# Altium schematic sheet ss.SchDoc
size A
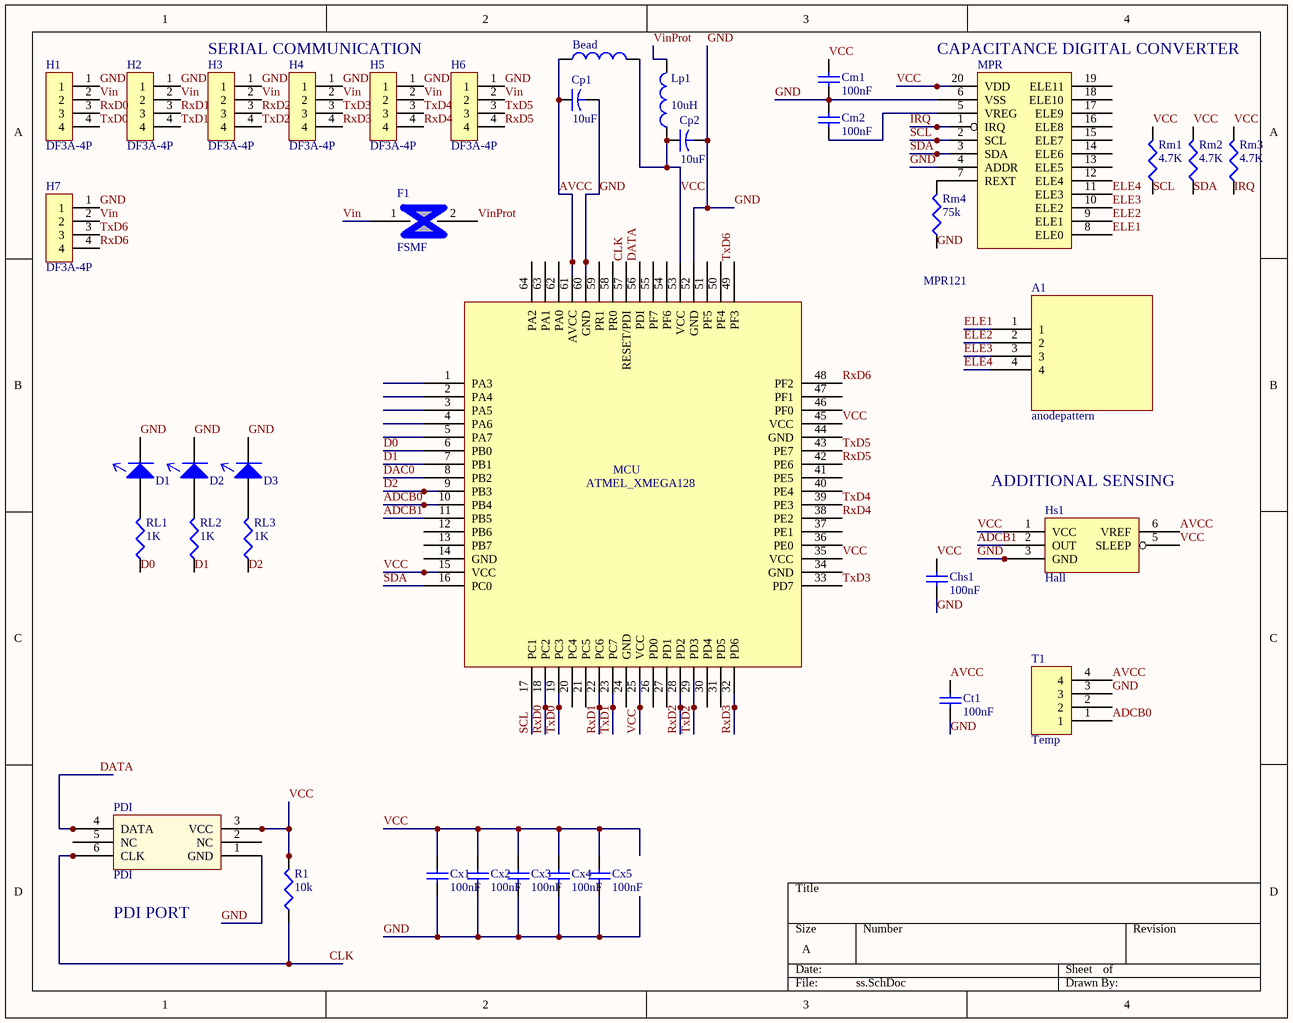
[diagram p0: ss.SchDoc]

## Parts
A1  anodepattern  [anodepattern]
Bead  (no value)  [C0402-DRL]
Chs1  value 100nF  [C0402-DRL]
Cm1  value 100nF  [C0402-DRL]
Cm2  value 100nF  [C0402-DRL]
Cp1  value 10uF  [C0603-DRL]
Cp2  value 10uF  [C0603-DRL]
Ct1  value 100nF  [C0402-DRL]
Cx1  value 100nF  [C0402-DRL]
Cx2  value 100nF  [C0402-DRL]
Cx3  value 100nF  [C0402-DRL]
Cx4  value 100nF  [C0402-DRL]
Cx5  value 100nF  [C0402-DRL]
D1  LEDSMD  [D1206-DRL]  (value not drawn)
D2  LEDSMD  [D1206-DRL]  (value not drawn)
D3  LEDSMD  [D1206-DRL]  (value not drawn)
F1  FSMF  [C0603-DRL]
H1  DF3A-4P  [UART]
H2  DF3A-4P  [UART]
H3  DF3A-4P  [UART]
H4  DF3A-4P  [UART]
H5  DF3A-4P  [UART]
H6  DF3A-4P  [UART]
H7  DF3A-4P  [UART]
Hs1  Hall  [HALL]
Lp1  value 10uH  [C0603-DRL]
MCU  ATMEL_XMEGA128  [QFN50P900X900X100-64N]
MPR  MPR121  [QFN40P300X300X60-20N]
PDI  PDI  [PDI_SMT]
R1  value 10k  [R0402-DRL]  (hidden comment: R)
RL1  value 1K  [R0402-DRL]  (hidden comment: R)
RL2  value 1K  [R0402-DRL]  (hidden comment: R)
RL3  value 1K  [R0402-DRL]  (hidden comment: R)
Rm1  value 4.7K  [R0402-DRL]  (hidden comment: R)
Rm2  value 4.7K  [R0402-DRL]  (hidden comment: R)
Rm3  value 4.7K  [R0402-DRL]  (hidden comment: R)
Rm4  value 75k  [R0603-DRL]  (hidden comment: R)
T1  Temp  [QFN50P100X130X55-4N]

## Nets
ADCB0: MCU.10(PB4) T1.1
ADCB1: Hs1.2(OUT) MCU.11(PB5)
AVCC: Bead.1 Cp1.1 Ct1.2 Hs1.6(VREF) MCU.61(AVCC) T1.4
CLK: MCU.57(RESET/PDI) PDI.6(CLK) R1.1
D0: MCU.6(PB0) RL1.1
D1: MCU.7(PB1) RL2.1
D2: MCU.9(PB3) RL3.1
DAC0: MCU.8(PB2)
DATA: MCU.56(PDI) PDI.4(DATA)
ELE1: A1.1 MPR.8(ELE0)
ELE2: A1.2 MPR.9(ELE1)
ELE3: A1.3 MPR.10(ELE2)
ELE4: A1.4 MPR.11(ELE3)
GND: Chs1.1 Cm1.1 Cm2.1 Cp1.2 Cp2.2 Ct1.1 Cx1.1 Cx2.1 Cx3.1 Cx4.1 Cx5.1 D1.1(K) D2.1(K) D3.1(K) H1.1 H2.1 H3.1 H4.1 H5.1 H6.1 H7.1 Hs1.3(GND) MCU.52(GND) MCU.60(GND) MPR.4(ADDR) MPR.6(VSS) PDI.1(GND) Rm4.1 T1.3
IRQ: MPR.1(IRQ) Rm3.1
RxD0: H1.3 MCU.18(PC2)
RxD1: H2.3 MCU.22(PC6)
RxD2: H3.3 MCU.28(PD2)
RxD3: H4.4 MCU.32(PD6)
RxD4: H5.4 MCU.38(PE2)
RxD5: H6.4 MCU.42(PE6)
RxD6: H7.4 MCU.48(PF2)
SCL: MCU.17(PC1) MPR.2(SCL) Rm1.1
SDA: MCU.16(PC0) MPR.3(SDA) Rm2.1
TxD0: H1.4 MCU.19(PC3)
TxD1: H2.4 MCU.23(PC7)
TxD2: H3.4 MCU.29(PD3)
TxD3: H4.3 MCU.33(PD7)
TxD4: H5.3 MCU.39(PE3)
TxD5: H6.3 MCU.43(PE7)
TxD6: H7.3 MCU.49(PF3)
VCC: Bead.2 Chs1.2 Cm1.2 Cp2.1 Cx1.2 Cx2.2 Cx3.2 Cx4.2 Cx5.2 Hs1.1(VCC) Hs1.5(SLEEP) Lp1.1 MCU.15(VCC) MCU.25(VCC) MCU.35(VCC) MCU.45(VCC) MCU.53(VCC) MPR.20(VDD) PDI.3(VCC) R1.2 Rm1.2 Rm2.2 Rm3.2
Vin: F1.1 H1.2 H2.2 H3.2 H4.2 H5.2 H6.2 H7.2
VinProt: F1.2 Lp1.2
NetCm2_2: Cm2.2 MPR.5(VREG)
NetD1_2: D1.2(A) RL1.2
NetD2_2: D2.2(A) RL2.2
NetD3_2: D3.2(A) RL3.2
NetMPR_7: MPR.7(REXT) Rm4.2

Not connected (* = marked no-connect by the designer): MCU 1(PA3) 2(PA4) 3(PA5) 4(PA6) 5(PA7) 12(PB6) 13(PB7) 14(GND) 20(PC4) 21(PC5) 24(GND) 26(PD0) 27(PD1) 30(PD4) 31(PD5) 34(GND) 36(PE0) 37(PE1) 40(PE4) 41(PE5) 44(GND) 46(PF0) 47(PF1) 50(PF4) 51(PF5) 54(PF6) 55(PF7) 58(PR0) 59(PR1) 62(PA0) 63(PA1) 64(PA2); MPR 12(ELE4) 13(ELE5) 14(ELE6) 15(ELE7) 16(ELE8) 17(ELE9) 18(ELE10) 19(ELE11); PDI 2(NC) 5(NC); T1 2

## Notes on the sheet
- SERIAL COMMUNICATION
- (near MPR) CAPACITANCE DIGITAL CONVERTER
- (near Hs1) ADDITIONAL SENSING
- (near PDI) PDI PORT

## Library data of the parts
Bead Lp1 = Inductor: Code_IEC: 1005; Published: 8-Jun-2000; LatestRevisionDate: 29-May-2009; LatestRevisionNote: IPC-7351 Footprint Added.; PackageReference: 0402-A; Publisher: Altium Limited; PackageDescription: Chip Inductor; Code_JEITA: 0402
Chs1 Cm1 Cm2 Ct1 Cx1-Cx5 = Cap: Capacitor; Published: 8-Jun-2000; LatestRevisionDate: 17-Jul-2002; LatestRevisionNote: Re-released for DXP Platform.; PackageReference: RAD-0.3; Publisher: Altium Limited
Cp1 Cp2 = Cap2: Capacitor; Published: 23-Sep-2002; PackageReference: CAPR5-4X5; Publisher: Altium Limited
D1-D3 = LEDSMD: LED
F1 = FSMF: Fuse PTC Reset
H1-H7 = DF3A-4P: 4pin header
Hs1 = Hall: 620-11-ND Hall Effect
R1 RL1-RL3 Rm1-Rm4 = R: Resistor; Published: 8-Jun-2000; Revision: July-2002: Re-released for DXP Platform.; Publisher: Altium Limited
T1 = Temp: 497-5814-1-ND Temperature sensor